# EAGLE schematic untitled (EAGLE 6.4)
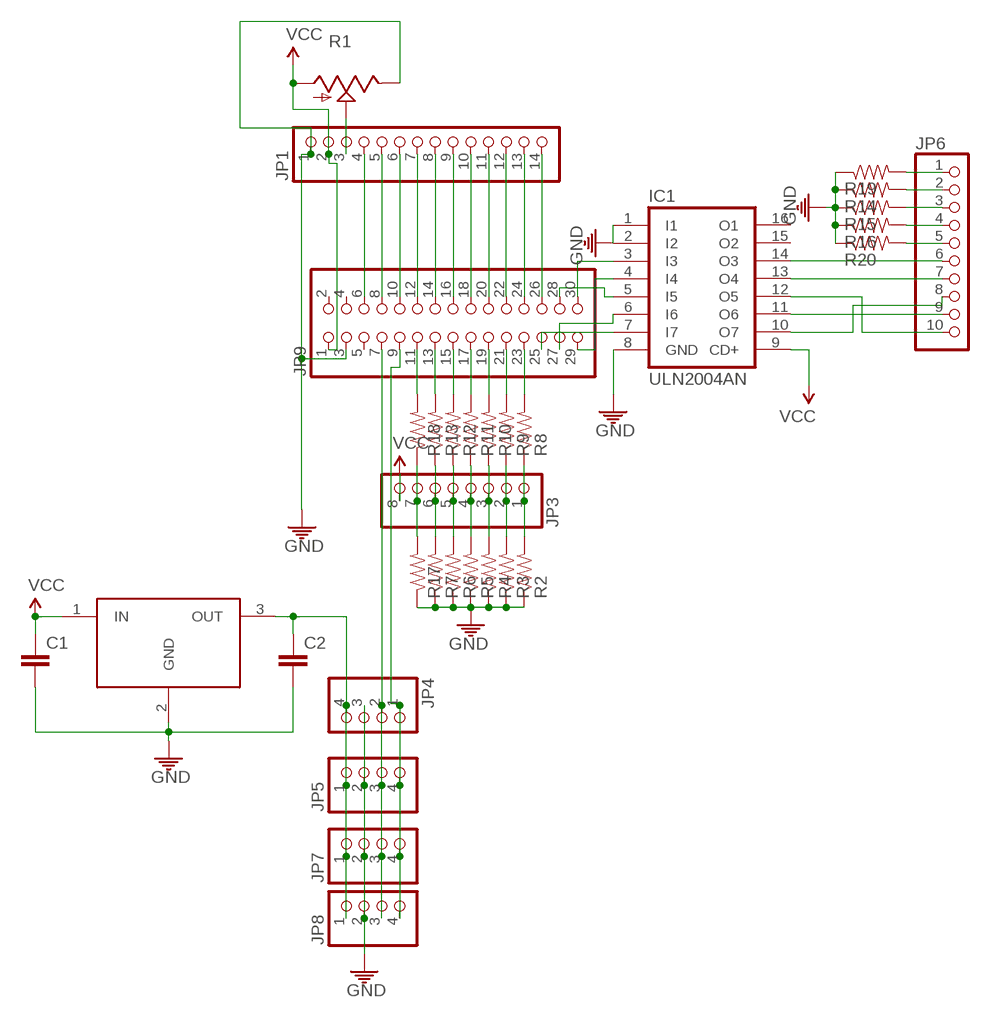
[diagram p0: schematic, sheet 1]

## Parts
C1  CAP0805  [0805]
C2  CAP0805  [0805]
IC1  ULN2004AN  [DIL16]
JP1  PINHD-1X14  [1X14]
JP3  PINHD-1X8/90  [1X08/90]
JP4  PINHD-1X4  [1X04]
JP5  PINHD-1X4  [1X04]
JP6  PINHD-1X10  [1X10]
JP7  PINHD-1X4  [1X04]
JP8  PINHD-1X4  [1X04]
JP9  PINHD-2X15/90  [2X15/90]
R1  TRIM_US-B90P  [SP19L]
R2  RESISTOR0805-RES  [0805]
R3  RESISTOR0805-RES  [0805]
R4  RESISTOR0805-RES  [0805]
R5  RESISTOR0805-RES  [0805]
R6  RESISTOR0805-RES  [0805]
R7  RESISTOR0805-RES  [0805]
R8  RESISTOR0805-RES  [0805]
R9  RESISTOR0805-RES  [0805]
R10  RESISTOR0805-RES  [0805]
R11  RESISTOR0805-RES  [0805]
R12  RESISTOR0805-RES  [0805]
R13  RESISTOR0805-RES  [0805]
R14  RESISTOR0805-RES  [0805]
R15  RESISTOR0805-RES  [0805]
R16  RESISTOR0805-RES  [0805]
R17  RESISTOR0805-RES  [0805]
R18  RESISTOR0805-RES  [0805]
R19  RESISTOR0805-RES  [0805]
R20  RESISTOR0805-RES  [0805]
U$5  LM3940IMP-3.3  [SOT223]

## Nets
3.3V: C2.1 JP4.4 JP5.1 JP7.1 JP8.1 U$5.3(OUT)
GND: C1.2 C2.2 IC1.1(I1) IC1.2(I2) IC1.8(GND) JP1.1 JP4.3 JP5.2 JP7.2 JP8.2 JP9.3 R1.E R2.1 R3.1 R4.1 R5.1 R6.1 R7.1 R14.1 R15.1 R16.1 R17.1 R19.1 R20.1 U$5.2(GND)
N$1: JP1.3 R1.S
N$2: JP3.1 R2.2 R8.1
N$3: JP3.2 R3.2 R9.1
N$4: JP1.4 JP9.6
N$5: JP1.5 JP9.8
N$6: JP1.6 JP9.10
N$7: JP1.7 JP9.12
N$8: JP4.1 JP5.4 JP7.4 JP8.4 JP9.9
N$9: JP1.8 JP9.14
N$10: JP1.9 JP9.16
N$11: JP1.10 JP9.18
N$12: JP1.11 JP9.20
N$13: JP1.12 JP9.22
N$14: JP1.13 JP9.24
N$15: JP3.3 R4.2 R10.1
N$16: JP3.4 R5.2 R11.1
N$17: JP3.5 R6.2 R12.1
N$18: JP3.6 R7.2 R13.1
N$19: JP9.13 R13.2
N$20: JP9.15 R12.2
N$21: JP9.17 R11.2
N$22: JP9.19 R10.2
N$23: JP9.21 R9.2
N$24: JP9.23 R8.2
N$25: JP1.14 JP9.26
N$26: JP3.7 R17.2 R18.1
N$27: IC1.7(I7) JP9.25
N$28: JP6.2 R14.2
N$29: JP6.3 R15.2
N$30: JP6.4 R16.2
N$31: IC1.12(O5) JP6.10
N$32: IC1.5(I5) JP9.28
N$33: JP4.2 JP5.3 JP7.3 JP8.3 JP9.7
N$35: JP9.11 R18.2
N$36: JP6.1 R19.2
N$37: JP6.5 R20.2
N$38: IC1.4(I4) JP9.29
N$39: IC1.3(I3) JP9.30
N$40: IC1.10(O7) JP6.8
N$41: IC1.11(O6) JP6.9
N$43: IC1.13(O4) JP6.7
N$44: IC1.14(O3) JP6.6
N$46: IC1.6(I6) JP9.27
VCC: C1.1 IC1.9(CD+) JP1.2 JP3.8 JP9.1 R1.A U$5.1(IN)
Unconnected: IC1.15(O2) IC1.16(O1) JP9.2 JP9.4 JP9.5

## Library data of the parts
C1 C2 = ASL:CAP: Capacitor Standard 0603 ceramic capacitor, and 0.1" leaded capacitor.
IC1 = uln-udn:ULN2004A: DRIVER ARRAY
JP1 = pinhead_non_standard:PINHD-1X14: PIN HEADER
JP3 = pinhead:PINHD-1X8: PIN HEADER
JP4 JP5 JP7 JP8 = pinhead_non_standard:PINHD-1X4: PIN HEADER
JP6 = pinhead:PINHD-1X10: PIN HEADER
JP9 = pinhead:PINHD-2X15: PIN HEADER
R1 = pot:TRIM_US-: POTENTIOMETER
R2-R20 = ASL:RESISTOR: Resistor Basic schematic elements and footprints for 0603, 1206, and PTH resistors.
U$5 = LM3940:LM3940IMP-3.3: 1A Low Dropout Regulator for 5V to 3.3V Conversion